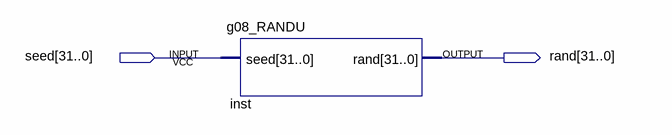
[diagram p0: schematic sheet]
// Quartus schematic random.bdf as structural Verilog: 1 symbols, 2 pins
module random (
  input  [31:0] seed,
  output [31:0] \rand 
);

  g08_RANDU inst (.seed(seed), .\rand (\rand ));
endmodule
